# EAGLE design Robot_Psoc (EAGLE 7.5.0)
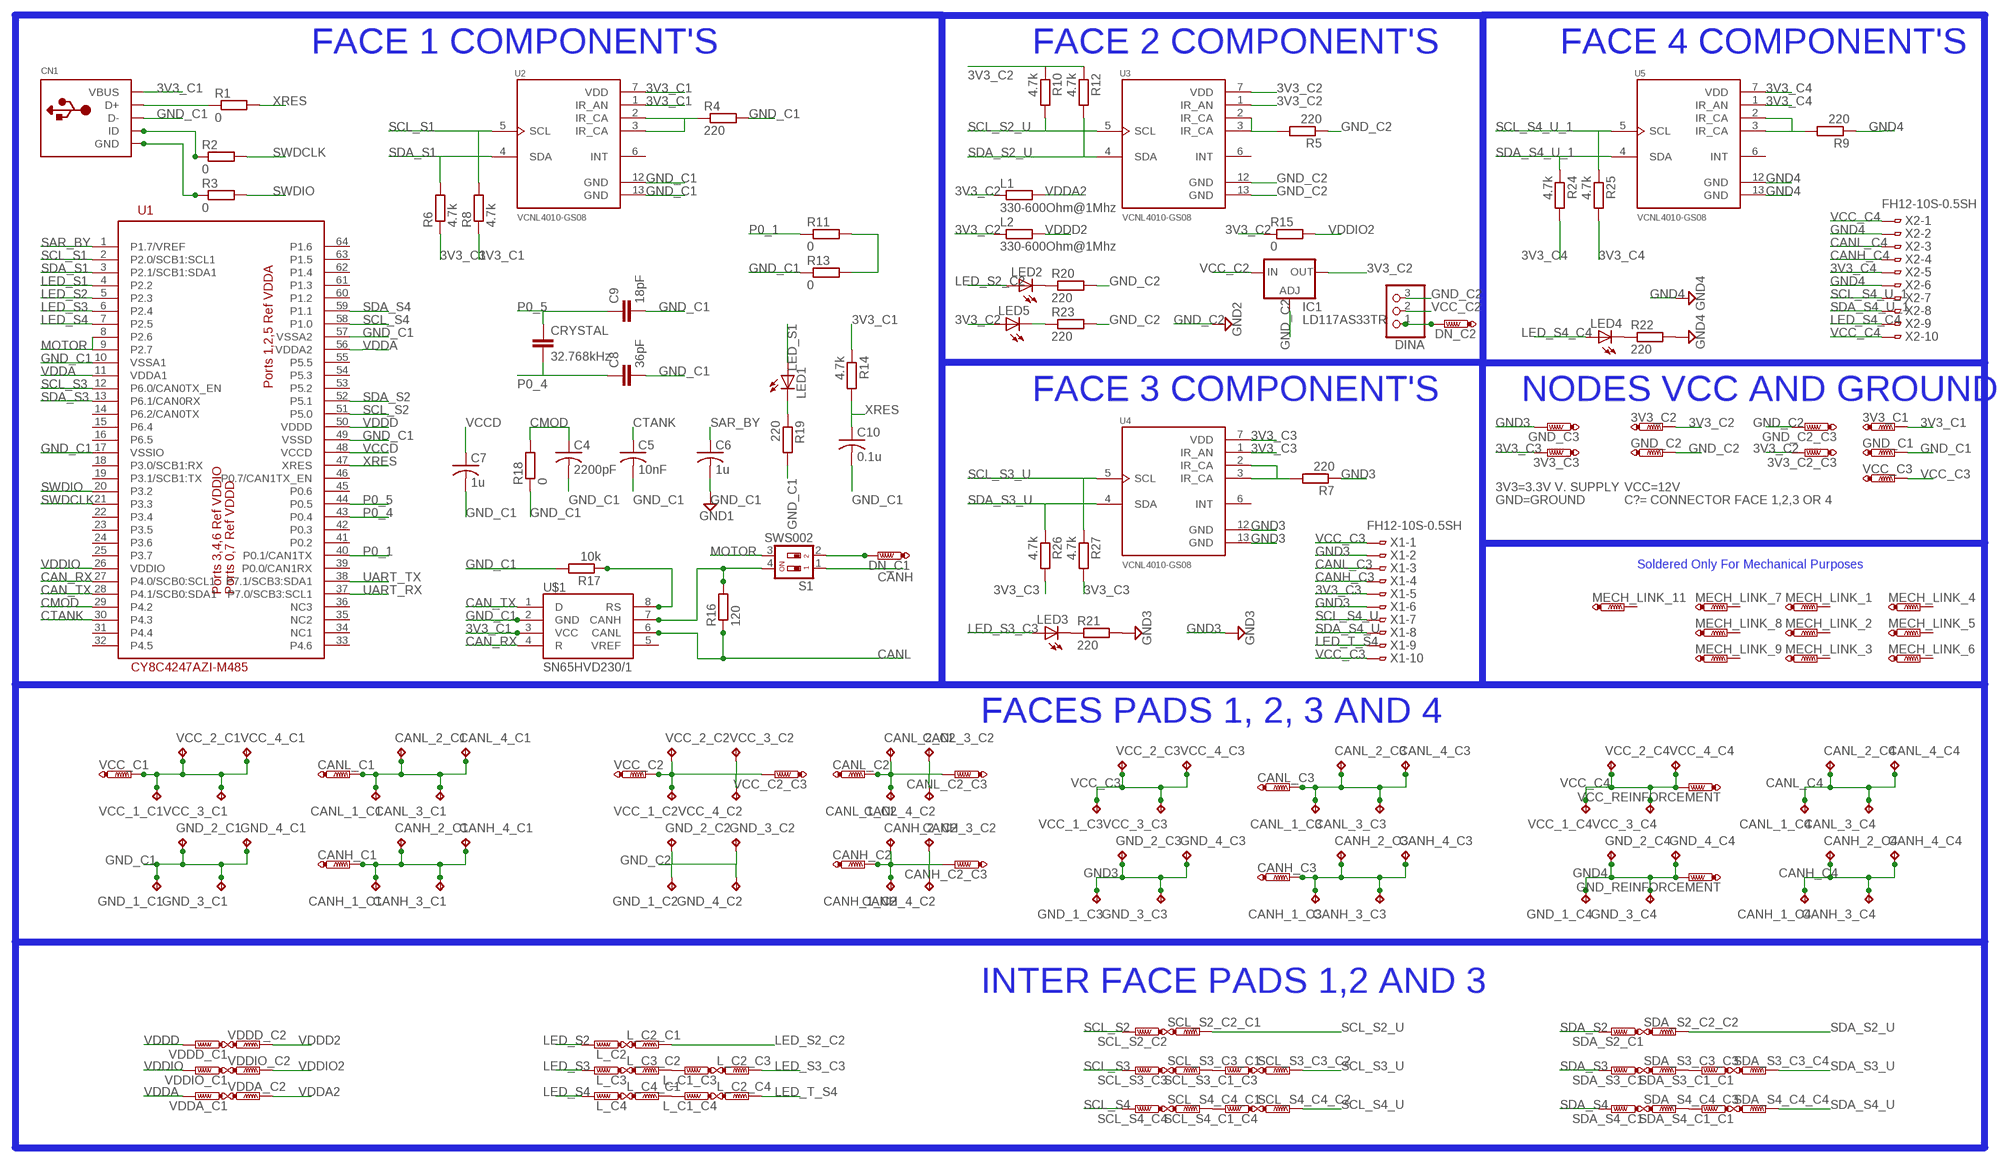
[diagram p0: schematic, sheet 1]

## Parts
3V3_C1  PTR1TP11R  [TP11R]
3V3_C2  PTR1TP11R  [TP11R]
3V3_C2_C3  PTR1TP11R  [TP11R]
3V3_C3  PTR1TP11R  [TP11R]
C4  2200pF  C-USC0805  [C0805]
C5  10nF  C-USC0805  [C0805]
C6  1u  C-USC0805  [C0805]
C7  1u  C-USC0805  [C0805]
C8  36pF  C-EUC0805  [C0805]
C9  18pF  C-EUC0805  [C0805]
C10  0.1u  C-USC0805  [C0805]
CANH_1_C1  TPB2,54  [B2,54]
CANH_1_C2  TPB2,54  [B2,54]
CANH_1_C3  TPB2,54  [B2,54]
CANH_1_C4  TPB2,54  [B2,54]
CANH_2_C1  TPB2,54  [B2,54]
CANH_2_C2  TPB2,54  [B2,54]
CANH_2_C3  TPB2,54  [B2,54]
CANH_2_C4  TPB2,54  [B2,54]
CANH_3_C1  TPB2,54  [B2,54]
CANH_3_C2  TPB2,54  [B2,54]
CANH_3_C3  TPB2,54  [B2,54]
CANH_3_C4  TPB2,54  [B2,54]
CANH_4_C1  TPB2,54  [B2,54]
CANH_4_C2  TPB2,54  [B2,54]
CANH_4_C3  TPB2,54  [B2,54]
CANH_4_C4  TPB2,54  [B2,54]
CANH_C1  PTR1TP11R  [TP11R]
CANH_C2  PTR1TP11R  [TP11R]
CANH_C2_C3  PTR1TP11R  [TP11R]
CANH_C3  PTR1TP11R  [TP11R]
CANL_1_C1  TPB2,54  [B2,54]
CANL_1_C2  TPB2,54  [B2,54]
CANL_1_C3  TPB2,54  [B2,54]
CANL_1_C4  TPB2,54  [B2,54]
CANL_2_C1  TPB2,54  [B2,54]
CANL_2_C2  TPB2,54  [B2,54]
CANL_2_C3  TPB2,54  [B2,54]
CANL_2_C4  TPB2,54  [B2,54]
CANL_3_C1  TPB2,54  [B2,54]
CANL_3_C2  TPB2,54  [B2,54]
CANL_3_C3  TPB2,54  [B2,54]
CANL_3_C4  TPB2,54  [B2,54]
CANL_4_C1  TPB2,54  [B2,54]
CANL_4_C2  TPB2,54  [B2,54]
CANL_4_C3  TPB2,54  [B2,54]
CANL_4_C4  TPB2,54  [B2,54]
CANL_C1  PTR1TP11R  [TP11R]
CANL_C2  PTR1TP11R  [TP11R]
CANL_C2_C3  PTR1TP11R  [TP11R]
CANL_C3  PTR1TP11R  [TP11R]
CN1  USBMINIB  [USB-MINIB]
CRYSTAL  32.768kHz  C-EUC0603  [C0603]
DINA  PINHD-1X3  [1X03]
DN_C1  PTR1TP11R  [TP11R]
DN_C2  PTR1TP11R  [TP11R]
GND_1_C1  TPB2,54  [B2,54]
GND_1_C2  TPB2,54  [B2,54]
GND_1_C3  TPB2,54  [B2,54]
GND_1_C4  TPB2,54  [B2,54]
GND_2_C1  TPB2,54  [B2,54]
GND_2_C2  TPB2,54  [B2,54]
GND_2_C3  TPB2,54  [B2,54]
GND_2_C4  TPB2,54  [B2,54]
GND_3_C1  TPB2,54  [B2,54]
GND_3_C2  TPB2,54  [B2,54]
GND_3_C3  TPB2,54  [B2,54]
GND_3_C4  TPB2,54  [B2,54]
GND_4_C1  TPB2,54  [B2,54]
GND_4_C2  TPB2,54  [B2,54]
GND_4_C3  TPB2,54  [B2,54]
GND_4_C4  TPB2,54  [B2,54]
GND_C1  PTR1TP11R  [TP11R]
GND_C2  PTR1TP11R  [TP11R]
GND_C2_C3  PTR1TP11R  [TP11R]
GND_C3  PTR1TP11R  [TP11R]
GND_REINFORCEMENT  PTR1TP11R  [TP11R]
IC1  LD117AS33TR  [SOT223]
L1  330-600Ohm@1Mhz  R-EU_R0805  [R0805]
L2  330-600Ohm@1Mhz  R-EU_R0805  [R0805]
L_C1_C3  PTR1TP11R  [TP11R]
L_C1_C4  PTR1TP11R  [TP11R]
L_C2  PTR1TP11R  [TP11R]
L_C2_C1  PTR1TP11R  [TP11R]
L_C2_C3  PTR1TP11R  [TP11R]
L_C2_C4  PTR1TP11R  [TP11R]
L_C3  PTR1TP11R  [TP11R]
L_C3_C2  PTR1TP11R  [TP11R]
L_C4  PTR1TP11R  [TP11R]
L_C4_C1  PTR1TP11R  [TP11R]
LED1  LEDCHIPLED_0805  [CHIPLED_0805]
LED2  LEDCHIPLED_0805  [CHIPLED_0805]
LED3  LEDCHIPLED_0805  [CHIPLED_0805]
LED4  LEDCHIPLED_0805  [CHIPLED_0805]
LED5  LEDCHIPLED_0805  [CHIPLED_0805]
MECH_LINK_1  PTR1TP11R  [TP11R]
MECH_LINK_2  PTR1TP11R  [TP11R]
MECH_LINK_3  PTR1TP11R  [TP11R]
MECH_LINK_4  PTR1TP11R  [TP11R]
MECH_LINK_5  PTR1TP11R  [TP11R]
MECH_LINK_6  PTR1TP11R  [TP11R]
MECH_LINK_7  PTR1TP11R  [TP11R]
MECH_LINK_8  PTR1TP11R  [TP11R]
MECH_LINK_9  PTR1TP11R  [TP11R]
MECH_LINK_11  PTR1TP11R  [TP11R]
R1  0  R-EU_R0805  [R0805]
R2  0  R-EU_R0805  [R0805]
R3  0  R-EU_R0805  [R0805]
R4  220  R-EU_R0805  [R0805]
R5  220  R-EU_R0805  [R0805]
R6  4.7k  R-EU_R0805  [R0805]
R7  220  R-EU_R0805  [R0805]
R8  4.7k  R-EU_R0805  [R0805]
R9  220  R-EU_R0805  [R0805]
R10  4.7k  R-EU_R0805  [R0805]
R11  0  R-EU_R0805  [R0805]
R12  4.7k  R-EU_R0805  [R0805]
R13  0  R-EU_R0805  [R0805]
R14  4.7k  R-EU_R0805  [R0805]
R15  0  R-EU_R0805  [R0805]
R16  120  R-EU_R0805  [R0805]
R17  10k  R-EU_R0805  [R0805]
R18  0  R-EU_R0805  [R0805]
R19  220  R-EU_R0805  [R0805]
R20  220  R-EU_R0805  [R0805]
R21  220  R-EU_R0805  [R0805]
R22  220  R-EU_R0805  [R0805]
R23  220  R-EU_R0805  [R0805]
R24  4.7k  R-EU_R0805  [R0805]
R25  4.7k  R-EU_R0805  [R0805]
R26  4.7k  R-EU_R0805  [R0805]
R27  4.7k  R-EU_R0805  [R0805]
S1  SWS002  [SMS-002]
SCL_S2_C2  PTR1TP11R  [TP11R]
SCL_S2_C2_C1  PTR1TP11R  [TP11R]
SCL_S3_C1_C3  PTR1TP11R  [TP11R]
SCL_S3_C3  PTR1TP11R  [TP11R]
SCL_S3_C3_C1  PTR1TP11R  [TP11R]
SCL_S3_C3_C2  PTR1TP11R  [TP11R]
SCL_S4_C1_C4  PTR1TP11R  [TP11R]
SCL_S4_C4  PTR1TP11R  [TP11R]
SCL_S4_C4_C1  PTR1TP11R  [TP11R]
SCL_S4_C4_C2  PTR1TP11R  [TP11R]
SDA_S2_C1  PTR1TP11R  [TP11R]
SDA_S2_C2_C2  PTR1TP11R  [TP11R]
SDA_S3_C1  PTR1TP11R  [TP11R]
SDA_S3_C1_C1  PTR1TP11R  [TP11R]
SDA_S3_C3_C3  PTR1TP11R  [TP11R]
SDA_S3_C3_C4  PTR1TP11R  [TP11R]
SDA_S4_C1  PTR1TP11R  [TP11R]
SDA_S4_C1_C1  PTR1TP11R  [TP11R]
SDA_S4_C4_C3  PTR1TP11R  [TP11R]
SDA_S4_C4_C4  PTR1TP11R  [TP11R]
U1  CY8C4247AZI-M485  [TQFP64-10X10]
U2  VCNL4010-GS08  [XDCR_VCNL4010-GS08]
U3  VCNL4010-GS08  [XDCR_VCNL4010-GS08]
U4  VCNL4010-GS08  [XDCR_VCNL4010-GS08]
U5  VCNL4010-GS08  [XDCR_VCNL4010-GS08]
U$1  SN65HVD230/1  [SO8]
VCC_1_C1  TPB2,54  [B2,54]
VCC_1_C2  TPB2,54  [B2,54]
VCC_1_C3  TPB2,54  [B2,54]
VCC_1_C4  TPB2,54  [B2,54]
VCC_2_C1  TPB2,54  [B2,54]
VCC_2_C2  TPB2,54  [B2,54]
VCC_2_C3  TPB2,54  [B2,54]
VCC_2_C4  TPB2,54  [B2,54]
VCC_3_C1  TPB2,54  [B2,54]
VCC_3_C2  TPB2,54  [B2,54]
VCC_3_C3  TPB2,54  [B2,54]
VCC_3_C4  TPB2,54  [B2,54]
VCC_4_C1  TPB2,54  [B2,54]
VCC_4_C2  TPB2,54  [B2,54]
VCC_4_C3  TPB2,54  [B2,54]
VCC_4_C4  TPB2,54  [B2,54]
VCC_C1  PTR1TP11R  [TP11R]
VCC_C2  PTR1TP11R  [TP11R]
VCC_C2_C3  PTR1TP11R  [TP11R]
VCC_C3  PTR1TP11R  [TP11R]
VCC_REINFORCEMENT  PTR1TP11R  [TP11R]
VDDA_C1  PTR1TP11R  [TP11R]
VDDA_C2  PTR1TP11R  [TP11R]
VDDD_C1  PTR1TP11R  [TP11R]
VDDD_C2  PTR1TP11R  [TP11R]
VDDIO_C1  PTR1TP11R  [TP11R]
VDDIO_C2  PTR1TP11R  [TP11R]
X1  FH12-10S-0.5SH  [FH12-10S-0.5SH]
X2  FH12-10S-0.5SH  [FH12-10S-0.5SH]

## Nets
3V3_C1: 3V3_C1.TP CN1.VBUS R6.1 R8.1 R14.1 U2.1(IR_AN) U2.7(VDD) U$1.3(VCC)
3V3_C2: 3V3_C2.TP 3V3_C2_C3.TP IC1.4(OUT) L1.1 L2.1 LED5.A R10.1 R12.1 R15.1 U3.1(IR_AN) U3.7(VDD)
3V3_C3: 3V3_C3.TP R26.2 R27.2 U4.1(IR_AN) U4.7(VDD) X1.5
3V3_C4: R24.2 R25.2 U5.1(IR_AN) U5.7(VDD) X2.5
CAN_RX: U1.27(P4.0/SCB0:SCL1) U$1.4(R)
CAN_TX: U1.28(P4.1/SCB0:SDA1) U$1.1(D)
CANH: CANH_1_C1.TP CANH_2_C1.TP CANH_3_C1.TP CANH_4_C1.TP CANH_C1.TP S1.1
CANH_C3: CANH_1_C3.TP CANH_2_C3.TP CANH_3_C3.TP CANH_4_C3.TP CANH_C3.TP X1.4
CANH_C4: CANH_1_C4.TP CANH_2_C4.TP CANH_3_C4.TP CANH_4_C4.TP X2.4
CANL: CANL_1_C1.TP CANL_2_C1.TP CANL_3_C1.TP CANL_4_C1.TP CANL_C1.TP R16.1 U$1.6(CANL)
CANL_C3: CANL_1_C3.TP CANL_2_C3.TP CANL_3_C3.TP CANL_4_C3.TP CANL_C3.TP X1.3
CANL_C4: CANL_1_C4.TP CANL_2_C4.TP CANL_3_C4.TP CANL_4_C4.TP X2.3
CMOD: C4.1 R18.2 U1.29(P4.2)
CTANK: C5.1 U1.30(P4.3)
GND3: GND_1_C3.TP GND_2_C3.TP GND_3_C3.TP GND_4_C3.TP GND_C3.TP R7.1 R21.2 U4.12(GND) U4.13(GND) X1.2 X1.6
GND4: GND_1_C4.TP GND_2_C4.TP GND_3_C4.TP GND_4_C4.TP GND_REINFORCEMENT.TP R9.1 R22.2 U5.12(GND) U5.13(GND) X2.2 X2.6
GND_C1: C4.2 C5.2 C6.2 C7.2 C8.2 C9.2 C10.2 CN1.D- GND_1_C1.TP GND_2_C1.TP GND_3_C1.TP GND_4_C1.TP GND_C1.TP R4.2 R13.1 R17.2 R18.1 R19.2 U1.10(VSSA1) U1.17(VSSIO) U1.49(VSSD) U1.57(VSSA2) U2.12(GND) U2.13(GND) U$1.2(GND) ; supply symbol labelled GND1
GND_C2: DINA.3 GND_1_C2.TP GND_2_C2.TP GND_3_C2.TP GND_4_C2.TP GND_C2.TP GND_C2_C3.TP IC1.1(ADJ) R5.1 R20.2 R23.2 U3.12(GND) U3.13(GND) ; supply symbol labelled GND2
LED_S1: LED1.A U1.4(P2.2)
LED_S2: L_C2.TP U1.5(P2.3)
LED_S2_C2: L_C2_C1.TP LED2.A
LED_S3: L_C3.TP U1.6(P2.4)
LED_S3_C3: L_C2_C3.TP LED3.A
LED_S4: L_C4.TP U1.7(P2.5)
LED_S4_C4: LED4.A X2.9
LED_T_S4: L_C2_C4.TP X1.9
MOTOR: S1.3 U1.8(P2.6) U1.9(P2.7)
N$1: CN1.D+ R1.1
N$2: CN1.ID R2.1
N$3: CN1.GND R3.1
N$4: R11.2 R13.2
N$5: R16.2 S1.4 U$1.7(CANH)
N$7: CANH_1_C2.TP CANH_2_C2.TP CANH_3_C2.TP CANH_4_C2.TP CANH_C2.TP CANH_C2_C3.TP
N$8: R7.2 U4.2(IR_CA) U4.3(IR_CA)
N$9: R17.1 U$1.8(RS)
N$10: SDA_S3_C1_C1.TP SDA_S3_C3_C3.TP
N$13: DN_C1.TP S1.2
N$14: LED1.C R19.1
N$15: LED2.C R20.1
N$16: LED3.C R21.1
N$17: LED4.C R22.1
N$18: LED5.C R23.1
N$19: DINA.1 DN_C2.TP
N$20: L_C1_C4.TP L_C4_C1.TP
N$21: R4.1 U2.2(IR_CA) U2.3(IR_CA)
N$22: L_C1_C3.TP L_C3_C2.TP
N$26: SCL_S3_C1_C3.TP SCL_S3_C3_C1.TP
N$27: SCL_S4_C1_C4.TP SCL_S4_C4_C1.TP
N$29: VCC_1_C1.TP VCC_2_C1.TP VCC_3_C1.TP VCC_4_C1.TP VCC_C1.TP
N$32: CANL_1_C2.TP CANL_2_C2.TP CANL_3_C2.TP CANL_4_C2.TP CANL_C2.TP CANL_C2_C3.TP
N$43: R5.2 U3.2(IR_CA) U3.3(IR_CA)
N$44: SDA_S4_C1_C1.TP SDA_S4_C4_C3.TP
N$46: R9.2 U5.2(IR_CA) U5.3(IR_CA)
P0_1: R11.1 U1.40(P0.1/CAN1TX)
P0_4: C8.1 CRYSTAL.2 U1.43(P0.4)
P0_5: C9.1 CRYSTAL.1 U1.44(P0.5)
SAR_BY: C6.1 U1.1(P1.7/VREF)
SCL_S1: R8.2 U1.2(P2.0/SCB1:SCL1) U2.5(SCL)
SCL_S2: SCL_S2_C2.TP U1.51(P5.0)
SCL_S2_U: R10.2 SCL_S2_C2_C1.TP U3.5(SCL)
SCL_S3: SCL_S3_C3.TP U1.12(P6.0/CAN0TX_EN)
SCL_S3_U: R27.1 SCL_S3_C3_C2.TP U4.5(SCL)
SCL_S4: SCL_S4_C4.TP U1.58(P1.0)
SCL_S4_U: SCL_S4_C4_C2.TP X1.7
SCL_S4_U_1: R25.1 U5.5(SCL) X2.7
SDA_S1: R6.2 U1.3(P2.1/SCB1:SDA1) U2.4(SDA)
SDA_S2: SDA_S2_C1.TP U1.52(P5.1)
SDA_S2_U: R12.2 SDA_S2_C2_C2.TP U3.4(SDA)
SDA_S3: SDA_S3_C1.TP U1.13(P6.1/CAN0RX)
SDA_S3_U: R26.1 SDA_S3_C3_C4.TP U4.4(SDA)
SDA_S4: SDA_S4_C1.TP U1.59(P1.1)
SDA_S4_U: SDA_S4_C4_C4.TP X1.8
SDA_S4_U_1: R24.1 U5.4(SDA) X2.8
SWDCLK: R2.2 U1.21(P3.3)
SWDIO: R3.2 U1.20(P3.2)
UART_RX: U1.37(P7.0/SCB3:SCL1)
UART_TX: U1.38(P7.1/SCB3:SDA1)
VCC_C2: DINA.2 IC1.3(IN) VCC_1_C2.TP VCC_2_C2.TP VCC_3_C2.TP VCC_4_C2.TP VCC_C2.TP VCC_C2_C3.TP
VCC_C3: VCC_1_C3.TP VCC_2_C3.TP VCC_3_C3.TP VCC_4_C3.TP VCC_C3.TP X1.1 X1.10
VCC_C4: VCC_1_C4.TP VCC_2_C4.TP VCC_3_C4.TP VCC_4_C4.TP VCC_REINFORCEMENT.TP X2.1 X2.10
VCCD: C7.1 U1.48(VCCD)
VDDA: U1.11(VDDA1) U1.56(VDDA2) VDDA_C1.TP
VDDA2: L1.2 VDDA_C2.TP
VDDD: U1.50(VDDD) VDDD_C1.TP
VDDD2: L2.2 VDDD_C2.TP
VDDIO: U1.26(VDDIO) VDDIO_C1.TP
VDDIO2: R15.2 VDDIO_C2.TP
XRES: C10.1 R1.2 R14.2 U1.47(XRES)
Unconnected: MECH_LINK_1.TP MECH_LINK_2.TP MECH_LINK_3.TP MECH_LINK_4.TP MECH_LINK_5.TP MECH_LINK_6.TP MECH_LINK_7.TP MECH_LINK_8.TP MECH_LINK_9.TP MECH_LINK_11.TP U1.14(P6.2/CAN0TX) U1.15(P6.4) U1.16(P6.5) U1.18(P3.0/SCB1:RX) U1.19(P3.1/SCB1:TX) U1.22(P3.4) U1.23(P3.5) U1.24(P3.6) U1.25(P3.7) U1.31(P4.4) U1.32(P4.5) U1.33(P4.6) U1.34(NC1) U1.35(NC2) U1.36(NC3) U1.39(P0.0/CAN1RX) U1.41(P0.2) U1.42(P0.3) U1.45(P0.6) U1.46(P0.7/CAN1TX_EN) U1.53(P5.2) U1.54(P5.3) U1.55(P5.5) U1.60(P1.2) U1.61(P1.3) U1.62(P1.4) U1.63(P1.5) U1.64(P1.6) U2.6(INT) U3.6(INT) U4.6(INT) U5.6(INT) U$1.5(VREF)

## Notes on the sheet
- FACE 1 COMPONENT'S | FACE 2 COMPONENT'S | FACE 4 COMPONENT'S
- FACE 3 COMPONENT'S | NODES VCC AND GROUND
- 3V3=3.3V V. SUPPLY | VCC=12V
- GND=GROUND | C?= CONNECTOR FACE 1,2,3 OR 4
- Soldered Only For Mechanical Purposes
- FACES PADS 1, 2, 3 AND 4
- INTER FACE PADS 1,2 AND 3

## Library data of the parts
3V3_C1 3V3_C2 3V3_C2_C3 3V3_C3 CANH_C1 CANH_C2 CANH_C2_C3 CANH_C3 CANL_C1 CANL_C2 CANL_C2_C3 CANL_C3 DN_C1 DN_C2 GND_C1 GND_C2 GND_C2_C3 GND_C3 GND_REINFORCEMENT L_C1_C3 L_C1_C4 L_C2 L_C2_C1 L_C2_C3 L_C2_C4 L_C3 L_C3_C2 L_C4 L_C4_C1 MECH_LINK_1-MECH_LINK_9 MECH_LINK_11 SCL_S2_C2 SCL_S2_C2_C1 SCL_S3_C1_C3 SCL_S3_C3 SCL_S3_C3_C1 SCL_S3_C3_C2 SCL_S4_C1_C4 SCL_S4_C4 SCL_S4_C4_C1 SCL_S4_C4_C2 SDA_S2_C1 SDA_S2_C2_C2 SDA_S3_C1 SDA_S3_C1_C1 SDA_S3_C3_C3 SDA_S3_C3_C4 SDA_S4_C1 SDA_S4_C1_C1 SDA_S4_C4_C3 SDA_S4_C4_C4 VCC_C1 VCC_C2 VCC_C2_C3 VCC_C3 VCC_REINFORCEMENT VDDA_C1 VDDA_C2 VDDD_C1 VDDD_C2 VDDIO_C1 VDDIO_C2 = testpad:PTR1: TEST PIN
C4-C7 C10 = rcl:C-US: CAPACITOR, American symbol
C8 C9 CRYSTAL = rcl:C-EU: CAPACITOR, European symbol
CANH_1_C1-CANH_1_C4 CANH_2_C1-CANH_2_C4 CANH_3_C1-CANH_3_C4 CANH_4_C1-CANH_4_C4 CANL_1_C1-CANL_1_C4 CANL_2_C1-CANL_2_C4 CANL_3_C1-CANL_3_C4 CANL_4_C1-CANL_4_C4 GND_1_C1-GND_1_C4 GND_2_C1-GND_2_C4 GND_3_C1-GND_3_C4 GND_4_C1-GND_4_C4 VCC_1_C1-VCC_1_C4 VCC_2_C1-VCC_2_C4 VCC_3_C1-VCC_3_C4 VCC_4_C1-VCC_4_C4 = testpad:TP: Test pad
CN1 = adafruit:USB: USB Connectors USBMINIB - Surface Mount Female Mini-B USB Connector 4UConnector: 06564 By microbuilder.eu Thru-hole RA Female Mini-B USB Connector 4UConnector: 18732 By ladyada.net
DINA = pinhead:PINHD-1X3: PIN HEADER
IC1 = v-reg:LD117A?*: Low drop fixed and adjustable positive voltage regulators 1 A Source: http://www.st.com/stonline/products/literature/ds/7194/ld1117axx.pdf
L1 L2 R1-R27 = rcl:R-EU_: RESISTOR, European symbol
LED1-LED5 = adafruit:LED: LED OSRAM: - CHIPLED LG R971, LG N971, LY N971, LG Q971, LY Q971, LO R971, LY R971 LH N974, LH R974 LS Q976, LO Q976, LY Q976 LO Q996 - Hyper CHIPLED LW Q18S LB Q993, LB Q99A, LB R99A - SideLED LS A670, LO A670, LY A670, LG A670, LP A670 LB A673, LV A673, LT A673, LW A673 LH A674 LY A675 LS A676, LA A676, LO A676, LY A676, LW A676 LS A679, LY A679, LG A679 - Hyper Micro SIDELED® LS Y876, LA Y876, LO Y876, LY Y876 LT Y87S - SmartLED LW L88C, LW L88S LB L89C, LB L89S, LG L890 LS L89K, LO L89K, LY L89K LS L896, LA L896, LO L896, LY L896 - TOPLED LS T670, LO T670, LY T670, LG T670, LP T670 LSG T670, LSP T670, LSY T670, LOP T670, LYG T670 LG T671, LOG T671, LSG T671 LB T673, LV T673, LT T673, LW T673 LH T674 LS T676, LA T676, LO T676, LY T676, LB T676, LH T676, LSB T676, LW T676 LB T67C, LV T67C, LT T67C, LS T67K, LO T67K, LY T67K, LW E67C LS E67B, LA E67B, LO E67B, LY E67B, LB E67C, LV E67C, LT E67C LW T67C LS T679, LY T679, LG T679 LS T770, LO T770, LY T770, LG T770, LP T770 LB T773, LV T773, LT T773, LW T773 LH T774 LS E675, LA E675, LY E675, LS T675 LS T776, LA T776, LO T776, LY T776, LB T776 LHGB T686 LT T68C, LB T68C - Hyper Mini TOPLED® LB M676 - Mini TOPLED Santana® LG M470 LS M47K, LO M47K, LY M47K Source: http://www.osram.convergy.de/
S1 = smd-special:SWS002: SMD Dip Switch 2 pol.
U1 = CypressPSoC:CY8C4247AZI-M485
U2-U5 = VCNL4010-GS08:VCNL4010-GS08
U$1 = texas_instruments:SN65HVD230/1
X1 X2 = con-hirose2:FH12-10S-0.5S: 0.5mm Pitch Connectors For FPC/FFC Source: Data sheet <http://www.hirose.co.jp/cataloge_hp/e58605370.pdf>; MPN: FH12-10S-0.5SH(55); OC_FARNELL: 1324540; OC_NEWARK: 34M6152

## Board
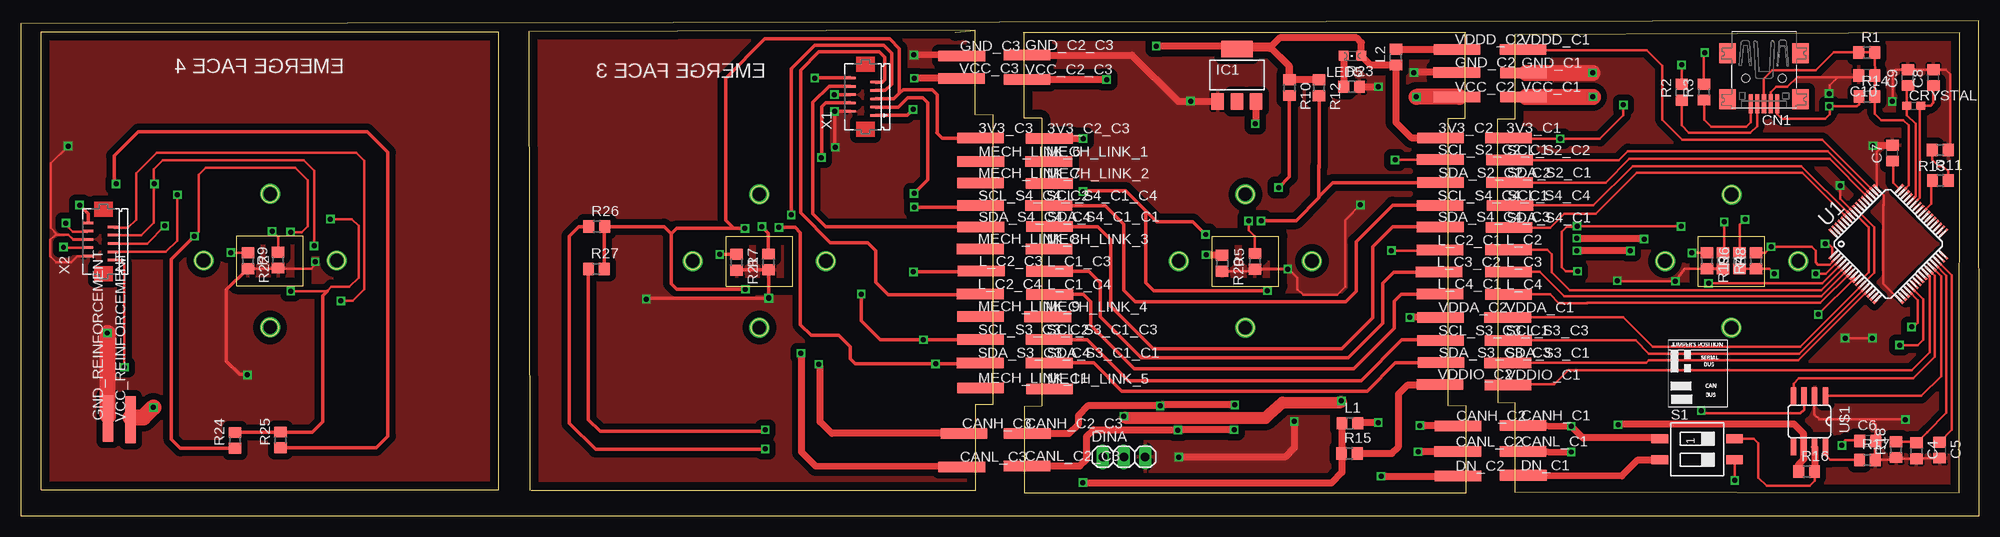
[diagram p1: board, top side]
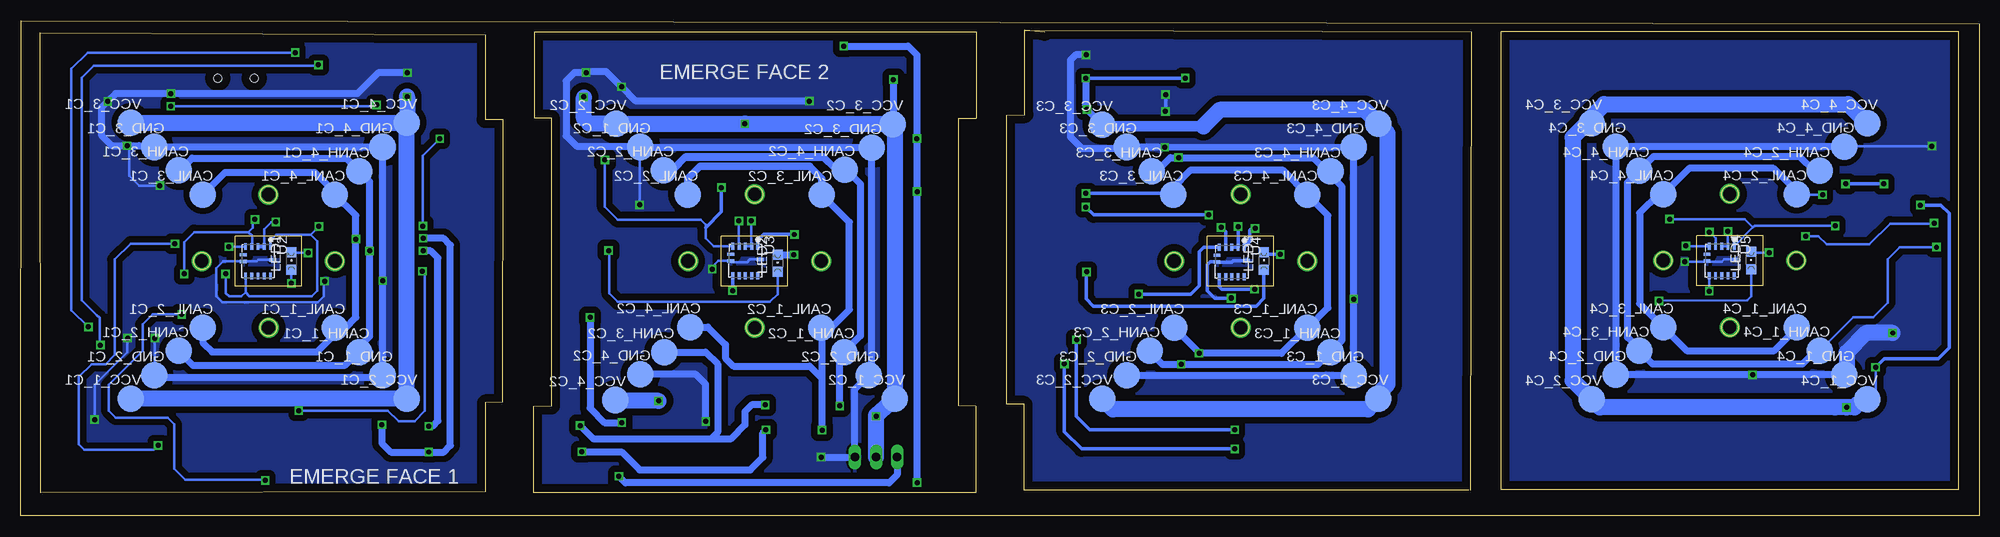
[diagram p2: board, bottom side, seen from below]

Size 235.34 x 59.49 mm. Coordinates in mm from the lower left corner, seen from the top.
Outline: 120.48,58.13 173.65,58.13
Outline: 114.68,58.34 114.68,48.21 116.87,48.13 116.84,13.41 114.76,13.39 114.76,3.1 61.32,3.05
Outline: 112.29,58.09 114.68,58.34
Outline: 114.68,58.34 61.06,58.17 61.19,3.05
Outline: 173.58,58.04 173.58,47.75 171.55,47.75 171.55,13.21 173.69,13.18 173.69,2.77 120.6,2.77 120.6,13.18 122.66,13.21 122.66,47.75 120.55,47.8 120.55,58.09
Outline: 0,0 235.34,0 235.29,59.49 0,59.11 0,0
Outline: 151.17,27.61 151.17,33.61 143.17,33.61 143.17,27.61 151.17,27.61
Outline: 2.45,3.16 2.45,58.16 57.45,58.16 57.45,3.16 2.45,3.16
Outline: 33.95,27.66 33.95,33.66 25.95,33.66 25.95,27.66 33.95,27.66
Outline: 92.75,27.61 92.75,33.61 84.75,33.61 84.75,27.61 92.75,27.61
Outline: 209.59,27.61 209.59,33.61 201.59,33.61 201.59,27.61 209.59,27.61
Outline: 179.53,47.65 177.42,47.68 177.47,13.67 179.5,13.56 179.5,2.9 232.97,2.79 233.02,58.04 179.53,57.81 179.53,47.65
Outline: circle at 139.17,30.61 radius 1
Outline: circle at 147.17,38.61 radius 1
Outline: circle at 155.17,30.61 radius 1
Outline: circle at 147.17,22.61 radius 1
Outline: circle at 21.95,30.66 radius 1
Outline: circle at 29.95,38.66 radius 1
Outline: circle at 37.95,30.66 radius 1
Outline: circle at 29.95,22.66 radius 1
Outline: circle at 80.75,30.61 radius 1
Outline: circle at 88.75,38.61 radius 1
Outline: circle at 96.75,30.61 radius 1
Outline: circle at 88.75,22.61 radius 1
Outline: circle at 197.59,30.61 radius 1
Outline: circle at 205.59,38.61 radius 1
Outline: circle at 213.59,30.61 radius 1
Outline: circle at 205.59,22.61 radius 1
Copper layers (1*16): Top 0.035mm / dielectric 1.5mm / Bottom 0.035mm
Design rules "default": minimum track width 10mil, minimum drill 24mil, track to track 8mil, track to pad 8mil, pad to pad 8mil, via to via 8mil, smd to smd 8mil, copper to edge 40mil, drill to drill 8mil, minimum pad ring 10mil, minimum via ring 8mil, stop-mask expansion 4mil, vias tented up to drill 0mil, thermal gap 10mil

### Footprints (pad centres in the part's own frame; a part is rotated, then mirrored left to right if it is on the bottom)
TP11R = smd 0.635 x 1.27: P$1 0.381,0; P$2 1.016,0; P$3 -0.254,0; P$4 -0.889,0; P$5 -1.524,0; P$6 1.613,0; P$7 2.21,0; P$8 -2.146,0; P$9 -2.769,0 | smd 1.1 x 1.1: TP 0,0
C0805 = smd 1.3 x 1.5: 1 -0.95,0; 2 0.95,0
B2,54 = smd 3.175 x 3.175 bottom: P$1 0,0 | smd 2.54 x 2.54 bottom: TP 0,0
USB-MINIB = smd 0.5 x 2.308: D+ 0,4.064; D- -0.8,4.064; GND 1.6,4.064; ID 0.8,4.064; VBUS -1.6,4.064 | smd 2 x 2.4: GND1 -4.4,-2; GND2 -4.4,3.5; GND3 4.4,3.5; GND4 4.4,-2 | hole 1: -2.2,1; 2.2,1
C0603 = smd 1.1 x 1: 1 -0.85,0; 2 0.85,0
1X03 = drill 1.016 long: 1 -2.54,0; 2 0,0; 3 2.54,0
SOT223 = smd 1.5 x 2: 1 -2.3,-3.15; 2 0,-3.15; 3 2.3,-3.15 | smd 3.8 x 2: 4 0,3.15
R0805 = smd 1.3 x 1.5: 1 -0.95,0; 2 0.95,0
CHIPLED_0805 = smd 1.2 x 1.2: A 0,-1.05; C 0,1.05
SMS-002 = smd 1.092 x 2.007: 1 -1.27,-4.496; 2 1.27,-4.496; 3 1.27,4.496; 4 -1.27,4.496
TQFP64-10X10 = smd 1.2 x 0.3: 1 -5.7,3.75; 2 -5.7,3.25; 3 -5.7,2.75; 4 -5.7,2.25; 5 -5.7,1.75; 6 -5.7,1.25; 7 -5.7,0.75; 8 -5.7,0.25; 9 -5.7,-0.25; 10 -5.7,-0.75; 11 -5.7,-1.25; 12 -5.7,-1.75; 13 -5.7,-2.25; 14 -5.7,-2.75; 15 -5.7,-3.25; 16 -5.7,-3.75; 33 5.7,-3.75; 34 5.7,-3.25; 35 5.7,-2.75; 36 5.7,-2.25; 37 5.7,-1.75; 38 5.7,-1.25; 39 5.7,-0.75; 40 5.7,-0.25; 41 5.7,0.25; 42 5.7,0.75; 43 5.7,1.25; 44 5.7,1.75; 45 5.7,2.25; 46 5.7,2.75; 47 5.7,3.25; 48 5.7,3.75 | smd 0.3 x 1.2: 17 -3.75,-5.7; 18 -3.25,-5.7; 19 -2.75,-5.7; 20 -2.25,-5.7; 21 -1.75,-5.7; 22 -1.25,-5.7; 23 -0.75,-5.7; 24 -0.25,-5.7; 25 0.25,-5.7; 26 0.75,-5.7; 27 1.25,-5.7; 28 1.75,-5.7; 29 2.25,-5.7; 30 2.75,-5.7; 31 3.25,-5.7; 32 3.75,-5.7; 49 3.75,5.7; 50 3.25,5.7; 51 2.75,5.7; 52 2.25,5.7; 53 1.75,5.7; 54 1.25,5.7; 55 0.75,5.7; 56 0.25,5.7; 57 -0.25,5.7; 58 -0.75,5.7; 59 -1.25,5.7; 60 -1.75,5.7; 61 -2.25,5.7; 62 -2.75,5.7; 63 -3.25,5.7; 64 -3.75,5.7
XDCR_VCNL4010-GS08 = smd 0.805 x 0.35: 1 -1.772,1.5; 2 -1.772,0.75; 3 -1.772,0; 4 -1.772,-0.75; 5 -1.772,-1.5; 7 1.772,-1.5; 8 1.772,-0.75; 9 1.772,0; 10 1.772,0.75; 11 1.772,1.5 | smd 0.4 x 0.805: 6 -0.8,-1.772; 12 -0.175,1.772; 13 0,-1.772
SO8 = smd 0.66 x 2.032: 1 -1.905,-3.073; 2 -0.635,-3.073; 3 0.635,-3.073; 4 1.905,-3.073; 5 1.905,3.073; 6 0.635,3.073; 7 -0.635,3.073; 8 -1.905,3.073
FH12-10S-0.5SH = smd 0.3 x 1.3: 1 -2.25,-1.195; 2 -1.75,1.853; 3 -1.25,-1.195; 4 -0.75,1.853; 5 -0.25,-1.195; 6 0.25,1.853; 7 0.75,-1.195; 8 1.25,1.853; 9 1.75,-1.195; 10 2.25,1.853

### Placement (x,y rotation side)
3V3_C1  179.07,45.42 0 top
3V3_C2  170.89,45.42 0 top
3V3_C2_C3  123.88,45.36 0 top
3V3_C3  115.62,45.39 0 top
C4  227.79,7.82 270 top
C5  230.58,7.9 270 top
C6  221.95,9.02 0 top
C7  224.92,43.59 90 top
C8  229.84,52.65 90 top
C9  226.77,52.65 90 top
C10  221.82,52.93 180 top
CANH_1_C1  194.67,19.69 0 top
CANH_1_C2  136.37,19.69 0 top
CANH_1_C3  77.95,19.69 0 top
CANH_1_C4  19.15,19.86 0 top
CANH_2_C1  216.38,19.81 0 top
CANH_2_C2  158.09,41.53 0 top
CANH_2_C3  99.67,19.81 0 top
CANH_2_C4  19.15,41.45 0 top
CANH_3_C1  216.38,41.53 0 top
CANH_3_C2  158.04,19.69 0 top
CANH_3_C3  99.42,41.4 0 top
CANH_3_C4  40.87,19.86 0 top
CANH_4_C1  194.67,41.4 0 top
CANH_4_C2  136.32,41.58 0 top
CANH_4_C3  77.95,41.4 0 top
CANH_4_C4  40.87,41.45 0 top
CANH_C1  180.8,10.87 0 top
CANH_C2  173,10.82 0 top
CANH_C2_C3  121.23,9.91 0 top
CANH_C3  113.61,9.91 0 top
CANL_1_C1  197.59,22.61 0 top
CANL_1_C2  139.17,22.61 0 top
CANL_1_C3  80.75,22.61 0 top
CANL_1_C4  21.95,22.66 0 top
CANL_2_C1  213.46,22.61 0 top
CANL_2_C2  155.17,38.61 0 top
CANL_2_C3  96.75,22.61 0 top
CANL_2_C4  21.95,38.66 0 top
CANL_3_C1  213.46,38.61 0 top
CANL_3_C2  139.06,38.58 0 top
CANL_3_C3  96.88,38.61 0 top
CANL_3_C4  37.95,22.66 0 top
CANL_4_C1  197.59,38.61 0 top
CANL_4_C2  154.86,22.68 0 top
CANL_4_C3  80.75,38.61 0 top
CANL_4_C4  37.95,38.66 0 top
CANL_C1  180.8,7.75 0 top
CANL_C2  172.95,7.72 0 top
CANL_C2_C3  121.18,5.99 0 top
CANL_C3  113.36,5.89 0 top
CN1  209.47,53.57 180 top
CRYSTAL  227.48,49.28 0 top
DINA  132.56,7.09 0 top
DN_C1  180.82,4.88 0 top
DN_C2  172.97,4.8 0 top
GND_1_C1  191.87,16.89 0 top
GND_1_C2  160.88,44.32 0 top
GND_1_C3  75.16,16.89 0 top
GND_1_C4  16.23,16.94 0 top
GND_2_C1  219.3,16.89 0 top
GND_2_C2  133.45,16.89 0 top
GND_2_C3  102.46,16.89 0 top
GND_2_C4  43.66,16.94 0 top
GND_3_C1  219.3,44.32 0 top
GND_3_C2  133.1,44.22 0 top
GND_3_C3  102.46,44.32 0 top
GND_3_C4  43.66,44.37 0 top
GND_4_C1  191.87,44.32 0 top
GND_4_C2  160.88,17.02 0 top
GND_4_C3  75.16,44.32 0 top
GND_4_C4  16.23,44.37 0 top
GND_C1  180.85,53.24 0 top
GND_C2  172.85,53.29 0 top
GND_C2_C3  121.21,55.37 0 top
GND_C3  113.36,55.27 0 top
GND_REINFORCEMENT  10.46,11.99 90 top
IC1  146.13,52.96 0 top
L1  159.72,11.13 0 top
L2  165.23,55.12 90 top
L_C1_C3  123.9,29.39 0 top
L_C1_C4  123.93,26.62 0 top
L_C2  179.04,31.98 0 top
L_C2_C1  170.81,31.93 0 top
L_C2_C3  115.7,29.41 0 top
L_C2_C4  115.57,26.64 0 top
L_C3  179.07,29.31 0 top
L_C3_C2  170.71,29.31 0 top
L_C4  179.07,26.62 0 top
L_C4_C1  170.81,26.67 0 top
LED1  202.82,30.61 0 bottom
LED2  144.37,30.35 0 bottom
LED3  85.95,30.61 0 bottom
LED4  27.41,30.66 0 bottom
LED5  160.05,55.27 90 top
MECH_LINK_1  123.8,42.57 0 top
MECH_LINK_2  123.88,39.95 0 top
MECH_LINK_3  123.85,32.05 0 top
MECH_LINK_4  123.7,23.93 0 top
MECH_LINK_5  123.9,15.27 0 top
MECH_LINK_6  115.65,42.57 0 top
MECH_LINK_7  115.62,39.98 0 top
MECH_LINK_8  115.57,32.08 0 top
MECH_LINK_9  115.6,23.98 0 top
MECH_LINK_11  115.6,15.37 0 top
R1  221.82,55.65 0 top
R2  199.59,50.9 90 top
R3  202.26,50.93 90 top
R4  204.57,30.66 270 top
R5  148.29,30.58 90 top
R6  206.55,30.66 90 top
R7  89.84,30.51 90 top
R8  208.53,30.66 90 top
R9  30.91,30.73 90 top
R10  152.45,51.46 270 top
R11  230.68,40.28 0 top
R12  156.01,51.44 270 top
R13  230.66,43.97 180 top
R14  221.84,50.39 0 top
R15  159.66,7.49 0 top
R16  214.6,5.31 0 top
R17  221.89,6.73 0 top
R18  225.35,7.95 90 top
R19  202.64,30.66 270 top
R20  144.37,30.35 270 top
R21  86.03,30.48 270 top
R22  27.28,30.66 270 top
R23  159.92,51.56 0 top
R24  25.73,9.07 90 top
R25  31.22,9.12 90 top
R26  69.22,34.75 0 top
R27  69.16,29.67 0 top
S1  201.45,8 270 top
SCL_S2_C2  179.17,42.75 0 top
SCL_S2_C2_C1  170.84,42.8 0 top
SCL_S3_C1_C3  123.85,21.18 0 top
SCL_S3_C3  179.02,21.08 0 top
SCL_S3_C3_C1  170.89,21.08 0 top
SCL_S3_C3_C2  115.6,21.18 0 top
SCL_S4_C1_C4  123.8,37.29 0 top
SCL_S4_C4  179.22,37.31 0 top
SCL_S4_C4_C1  170.81,37.29 0 top
SCL_S4_C4_C2  115.62,37.29 0 top
SDA_S2_C1  179.17,40.06 0 top
SDA_S2_C2_C2  170.89,40.03 0 top
SDA_S3_C1  178.97,18.39 0 top
SDA_S3_C1_C1  123.88,18.39 0 top
SDA_S3_C3_C3  170.94,18.42 0 top
SDA_S3_C3_C4  115.57,18.39 0 top
SDA_S4_C1  179.12,34.65 0 top
SDA_S4_C1_C1  123.9,34.75 0 top
SDA_S4_C4_C3  170.84,34.72 0 top
SDA_S4_C4_C4  115.65,34.72 0 top
U1  224.41,32.66 45 top
U2  206.83,30.58 270 bottom
U3  148.26,30.63 270 bottom
U4  89.81,30.51 270 bottom
U5  30.94,30.63 270 bottom
U$1  214.93,11.35 180 top
VCC_1_C1  222.1,14.1 0 top
VCC_1_C2  130.33,14.1 0 top
VCC_1_C3  72.24,14.1 0 top
VCC_1_C4  13.44,14.02 0 top
VCC_2_C1  188.95,14.1 0 top
VCC_2_C2  163.8,47.12 0 top
VCC_2_C3  105.38,14.1 0 top
VCC_2_C4  46.58,14.02 0 top
VCC_3_C1  222.1,47.24 0 top
VCC_3_C2  130.56,47.07 0 top
VCC_3_C3  105.38,46.99 0 top
VCC_3_C4  46.58,47.17 0 top
VCC_4_C1  188.95,47.24 0 top
VCC_4_C2  163.88,13.92 0 top
VCC_4_C3  72.24,47.12 0 top
VCC_4_C4  13.44,47.17 0 top
VCC_C1  180.85,50.34 0 top
VCC_C2  172.87,50.34 0 top
VCC_C2_C3  121.21,52.45 0 top
VCC_C3  113.31,52.58 0 top
VCC_REINFORCEMENT  13.16,11.84 90 top
VDDA_C1  178.97,23.85 0 top
VDDA_C2  170.89,23.85 0 top
VDDD_C1  180.8,56.03 0 top
VDDD_C2  172.87,56.06 0 top
VDDIO_C1  178.99,15.75 0 top
VDDIO_C2  170.81,15.8 0 top
X1  101.52,50.37 90 top
X2  9.93,32.97 90 top

### Tracks (layer width: path | path; a pad name or v marks a point on that pad's centre or on a via)
3V3_C1  (via drill 0.6)
  Top 0.305: 220.9,50.38 R14.1 220.89,49.47 220.65,49.22 v217.32,49.22 | 217.42,49.17 v217.32,49.22 | v192.58,49.38 192.58,48.13 189.76,45.31 v184.99,45.31 | v184.99,45.31 180.14,45.31 179.81,45.64 179.3,45.64 3V3_C1.TP 179.17,45.31 v184.99,45.31 | CN1.VBUS 211.07,48.26 211.61,47.73 216.81,47.73 217.37,48.28 217.37,49.17 v217.32,49.22 | v199.52,34.77 187.2,34.8 v187.02,34.82 186.94,34.75 185.8,34.75 185.17,34.11 185.17,29.9 185.67,29.39 v187.07,29.39 | U$1.3 214.3,12.78 213.84,12.32 202.26,12.32 v201.93,12.65 | R6.1 R8.1 210.09,29.71 v210.72,29.08
  Bottom 0.305: v217.32,49.22 192.74,49.22 v192.58,49.38 | U2.7 208.33,26.85 | 208.33,26.85 207.87,26.39 200.36,26.39 199.72,27.03 199.72,33.02 200.48,33.78 200.51,33.78 | U2.1 205.33,33.1 204.65,33.78 200.51,33.78 | 200.51,33.78 v199.52,34.77 | v187.02,34.82 187.02,43.28 v184.99,45.31 | v201.93,12.65 191.21,12.65 189.94,11.38 188.01,11.38 186.79,12.6 186.79,29.11 v187.07,29.39 | v210.72,29.08 210.72,26.77 210.31,26.36 208.82,26.36 208.33,26.85
3V3_C2  (via drill 0.6)
  Top 0.406: 150.01,56.16 150.15,56.3 | v149.81,27.05 136.12,27.05 135.18,27.99 135.18,36.65 | 135.18,36.65 132.77,39.06 127.74,39.06 v127.63,38.96 | 135.18,36.65 136.5,35.33 140.84,35.33 v142.37,33.81
  Top 0.813: 3V3_C2.TP 170.87,45.44 167.08,45.44 165.23,47.3 L2.1 162.2,54.17 LED5.A 161.1,56.86 160.53,57.43 151.28,57.43 150.15,56.3 | 150.15,56.3 150.04,56.19 146.2,56.19 IC1.4 | R15.1 158.77,7.54 L1.1 158.77,5.22 157.48,3.94 127.69,3.94 v127.63,3.99 | v127.66,45.34 123.9,45.34 3V3_C2_C3.TP | R12.1 152.48,52.39 | 152.48,52.39 R10.1 152.45,54 150.15,56.3 | 152.48,52.39 152.48,54 150.04,56.44 v136.45,56.44
  Bottom 0.406: U3.7 149.76,27.1 v149.81,27.05 | U3.1 146.76,33.17 146.08,33.86 142.42,33.86 v142.37,33.81
  Bottom 0.813: v127.63,3.99 v127.63,38.96 127.63,45.31 v127.66,45.34 127.66,55.4 128.7,56.44 v136.45,56.44
3V3_C3  (via drill 0.6)
  Top 0.406: 3V3_C3.TP 110.74,45.39 110.08,46.05 110.11,46.08 110.11,50.62 109.5,51.23 106.02,51.23 105.56,50.78 | X1.5 104.91,50.12 105.56,50.78 | v87.07,27.23 78.84,27.23 78.16,27.92 78.16,33.88 | 78.16,33.88 78.82,34.54 v87.02,34.54 85.67,34.54 84.68,35.53 84.68,52.58 89.41,57.3 104.39,57.3 105.56,56.13 105.56,50.78 | 78.16,33.88 77.29,34.75 R26.2 70.11,34.7 R27.2
  Bottom 0.406: U4.7 91.31,27.53 91.03,27.25 87.1,27.25 v87.07,27.23 | 87.4,34.54 v87.02,34.54 87.1,34.62 87.33,34.62 87.4,34.54 | 87.4,34.54 87.63,34.31 87.63,33 | 87.63,33 87.63,32.96 U4.1 88.31,32.31 87.63,33
3V3_C4  (via drill 0.6)
  Top 0.305: X2.5 15.17,32.72 v17.3,34.85 | v32.44,27 36.8,27 37.29,27.51 39.5,27.51 40.59,28.6 40.59,34.85 39.78,35.66 v37.21,35.66
  Top 0.406: R24.2 31.17,10.02 R25.2 35.04,10.07 36.27,11.3 36.27,26.47 36.8,27
  Bottom 0.305: v17.3,34.85 26.99,34.85 27.19,34.66 | 27.19,34.66 U5.1 | U5.7 32.44,27.15 v32.44,27 | v37.21,35.66 28.19,35.66 27.19,34.66
CAN_RX
  Top 0.305: U1.27 229.32,29.48 229.37,29.48 230,28.85 230,19.1 227.43,16.53 213.66,16.53 213.03,15.9 U$1.4 213.11,14.5
CAN_TX
  Top 0.305: U1.28 230.76,28.78 230.76,16.79 228.4,14.43 U$1.1
CANH  (via drill 0.6)
  Top 0.813: S1.1 196.85,9.37 187.71,9.37 v186.31,10.77 | 186.36,10.72 v186.31,10.77 | CANH_C1.TP 186.28,10.8 v186.31,10.77 | v193.42,31.83 187.02,31.83 v186.99,31.85
  Bottom 0.813: 216.89,19.81 CANH_2_C1.TP 214.63,18.06 196.42,18.06 194.79,19.69 CANH_1_C1.TP | CANH_1_C1.TP 193.4,19.69 | CANH_1_C1.TP 194.67,20.32 193.42,21.56 v193.42,31.83 193.42,40.16 CANH_4_C1.TP 196.24,42.98 214.76,42.98 216.2,41.53 CANH_3_C1.TP | v186.31,10.77 185.85,10.77 185.22,11.41 185.22,30.99 186.08,31.85 v186.99,31.85
CANH_C3  (via drill 0.6)
  Top 0.406: X1.4 96.74,49.62 96.27,49.15 96.27,43.1 v96.22,43.05
  Top 0.813: CANH_C3.TP 97.46,9.91 96.06,11.3 96.06,17.81 v95.88,18.21
  Bottom 0.813: CANH_3_C3.TP 98.86,41.4 97.21,43.05 v96.22,43.05 80.04,43.05 78.38,41.4 | 78.38,41.4 76.61,39.62 76.61,21.03 CANH_1_C3.TP 79.43,18.21 v95.88,18.21 98.15,18.21 99.67,19.71 CANH_2_C3.TP | CANH_4_C3.TP 78.38,41.4
CANH_C4  (via drill 0.6)
  Top 0.305: X2.4 5.19,32.22 v5.13,32.28
  Bottom 0.305: v5.13,32.28 9.55,32.28 10.97,30.86 10.97,25.63 12.73,23.88 15.14,23.88 CANH_1_C4.TP
  Bottom 0.813: CANH_1_C4.TP 19.61,19.86 21.23,18.24 39.24,18.24 CANH_3_C4.TP 40.87,20.07 42.24,21.44 42.24,40.08 CANH_4_C4.TP 39.17,43.16 21.54,43.16 19.84,41.45 CANH_2_C4.TP
CANL  (via drill 0.6)
  Top 0.305: 213.65,6.24 213.72,6.3 | 214.3,6.86 U$1.6 214.27,8.25 214.27,6.86 214.25,6.83 213.72,6.3 | 213.72,6.27 213.72,6.3 | 191.97,11.02 v191.95,10.95
  Top 0.813: R16.1 213.65,6.24 | CANL_C1.TP v186.31,7.67 | v186.97,33.35 194.97,33.35 v195.07,33.25 | 214.3,6.86 213.72,6.27 | 214.25,6.83 214.25,9.88 213.11,11.02 191.97,11.02
  Bottom 0.305: 186.33,7.65 v186.31,7.67
  Bottom 0.813: CANL_3_C1.TP 210.82,41.25 199.97,41.25 197.59,38.86 CANL_4_C1.TP 195.07,36.09 v195.07,33.25 195.07,23.85 196.32,22.61 CANL_1_C1.TP 197.31,22.33 197.31,22.12 199.72,19.71 212.34,19.71 213.46,20.83 CANL_2_C1.TP | v186.31,7.67 184.51,7.67 183.72,8.46 183.72,32.54 184.53,33.35 v186.97,33.35 | v191.95,10.95 191.95,8.74 190.86,7.65 186.33,7.65
CANL_C3  (via drill 0.6)
  Top 0.406: X1.3 105.46,49.12 106.58,50.24 108.38,50.24 108.97,49.66 108.97,40.36 v107.34,38.73
  Top 0.813: CANL_C3.TP 95.5,5.97 93.83,7.65 93.83,19.15 v93.75,19.53
  Bottom 0.406: v107.34,38.73 97.33,38.73 96.88,39.19
  Bottom 0.813: CANL_3_C3.TP 96.88,39.19 96.88,39.45 94.74,41.58 83.72,41.58 CANL_4_C3.TP 78.26,36.12 78.26,24.99 80.64,22.61 CANL_1_C3.TP 83.87,19.53 v93.75,19.53 93.62,19.48 CANL_2_C3.TP
CANL_C4  (via drill 0.6)
  Top 0.305: X2.3 17.42,31.72 18.77,33.07 18.77,38.53 v18.82,38.58
  Bottom 0.305: v18.82,38.58 21.87,38.58 CANL_2_C4.TP
  Bottom 0.813: CANL_2_C4.TP 21.95,39.01 24.69,41.76 34.85,41.76 CANL_4_C4.TP 38.53,38.66 40.79,36.4 40.79,25.5 CANL_3_C4.TP 35.08,19.79 24.69,19.79 21.95,22.53 CANL_1_C4.TP
CMOD
  Top 0.305: U1.29 231.39,28.85 231.39,12.37 229.08,10.06 229.07,10.06 C4.1 | 227.66,8.9 R18.2
  Top 0.813: 227.66,8.9 C4.1
CTANK
  Top 0.305: U1.30 232.05,28.91 232.05,10.32 C5.1
GND3  (via drill 0.6)
  Top 0.406: R21.2 86.06,29.56 R7.1 89.87,29.53 v89.87,26.19 | X1.6 v97.77,50.62 v97.76,50.62 | v97.79,48.59 99.64,48.59 X1.2 97.87,48.62 97.82,48.56 97.82,44.47 v97.87,44.3 | v89.89,26.14 75.26,26.14 v75.16,26.03
  Top 0.813: GND_C3.TP v107.31,55.4
  Bottom 0.406: v97.76,50.62 97.76,48.62 v97.79,48.59 | U4.12 89.61,30.68 89.84,30.45 91.54,30.45 U4.13 92.43,30.5 92.74,30.2 92.74,27.03 91.87,26.16 89.92,26.16 | 89.92,26.16 89.89,26.16 v89.87,26.19 | 89.92,26.16 v89.89,26.14
  Bottom 0.813: GND_2_C3.TP GND_1_C3.TP v75.16,26.03 GND_4_C3.TP v97.87,44.3 98.63,44.32 GND_3_C3.TP 102.62,44.17 107.85,44.17 109.22,45.54 109.22,54.76 108.58,55.4 v107.31,55.4
  pour Top (isolate 0.762): 61.04,3 114.88,2.62 114.73,13.26 116.92,13.13 116.61,48.03 114.78,47.85 114.68,58.24 61.04,58.24
  pour Bottom (isolate 0.762): 61.04,2.9 114.58,3.02 114.53,13.33 116.99,13.36 116.76,48.13 114.66,47.88 114.53,58.29 61.04,58.24
GND4  (via drill 0.6)
  Top 0.305: R22.2 30.84,29.71 R9.1 30.98,29.72 34.87,29.72 35.38,30.23 v35.38,30.53 | X2.2 6.78,31.22 6.05,30.48 4.24,30.48 3.56,31.17 3.56,33.15 4.22,33.81 4.39,33.81 | 5.69,33.81 5.71,33.81 6.32,33.2 8.06,33.2 X2.6 6.28,33.22 5.69,33.81 | 5.69,33.81 4.39,33.81 | 4.39,33.81 3.61,34.59 3.61,42.34 v5.69,44.42 | 27.28,16.99 v27.23,16.94
  Top 0.406: 27.28,16.99 26.31,16.99 24.71,18.59 24.71,27.14 R22.2
  Top 1.93: GND_REINFORCEMENT.TP 10.46,21.92 v10.41,21.97
  Bottom 0.305: U5.12 30.66,30.81 30.94,30.53 32.61,30.53 | 32.61,30.53 U5.13 | v5.69,44.42 16.18,44.42 GND_4_C4.TP | 32.61,30.53 v35.38,30.53
  Bottom 0.813: GND_1_C4.TP v27.23,16.94 GND_2_C4.TP GND_3_C4.TP GND_4_C4.TP
  Bottom 1.93: v10.41,21.97 13.56,21.97 15.93,19.61 15.93,17.25 GND_1_C4.TP
  pour Top (isolate 0.762): 2.59,3.17 57.53,3.17 57.53,58.09 2.39,58.09 2.39,3.23
  pour Bottom (isolate 0.762): 2.59,3.17 57.53,3.17 57.53,58.09 2.39,58.09 2.39,3.23
GND_C1  (via drill 0.6)
  Top 0.305: 225.37,6.98 R18.1 | U1.17 225.76,25.98 223.82,27.92 223.82,37.34 223.85,37.36 223.85,38.53 U1.49 223.03,43.73 223.8,44.5 224.88,44.5 C7.2 | U1.10 220.94,28.1 220.94,28.13 222.07,29.26 222.07,34.65 | 222.07,34.65 U1.57 | CN1.D- 210.29,50.88 210.95,51.54 212.29,51.54 213.46,52.7 220.64,52.7 C10.2 220.83,52.93 220.57,52.68 218.36,52.68 217.4,51.71 217.4,50.85 v217.3,50.75 | C5.2 227.86,6.95 C4.2 225.48,6.87 R18.1 | R18.1 225.08,6.73 R17.2 222.84,8.97 C6.2 222.9,10.94 222.25,11.58 | 222.25,11.58 216.15,11.58 | 216.15,11.58 216.13,11.58 215.54,12.17 215.54,12.19 | 215.54,12.19 215.54,14.4 | 215.54,14.4 U$1.2 215.54,14.43 215.54,14.4 | R19.2 R4.2 199.96,29.71 v198.83,28.19 192.05,28.22 v191.85,28.25 | 222.07,34.65 222.07,34.67 218.67,38.08 218.67,39.62 v218.62,39.67 | R13.1 231.88,44.24 231.88,53.06 231.33,53.6 C8.2 C9.2 225.33,53.6 224.94,53.21 224.94,50.22 v224.89,49.81 | 215.54,12.19 216.15,11.58 | 222.25,11.58 226.44,11.58 v226.47,11.56 | v219.23,21.36 v222.5,21.36 219.25,21.36 v219.23,21.34
  Top 0.813: 224.88,44.5 v222.55,44.47
  Top 1.93: GND_C1.TP v188.87,53.24
  Bottom 0.305: U2.12 206.81,30.76 206.98,30.58 U2.13 211.02,30.58 211.84,29.77 211.84,26.39 211.12,25.68 199.64,25.68 198.96,26.36 198.96,28.32 v198.83,28.19 | v218.62,39.67 221.11,39.67 222.33,40.89 222.33,44.25 v222.55,44.47 | v226.47,11.56 226.47,15.75 222.55,19.66 222.55,21.11 v222.5,21.36 | v219.23,21.36 v219.23,21.34 | v219.23,21.34 219.23,16.97 GND_2_C1.TP | v219.23,21.34 219.23,16.99 219.3,16.92
  Bottom 0.61: 191.49,43.94 GND_4_C1.TP
  Bottom 0.813: v188.87,53.24 192.4,53.24 194.89,50.75 v217.3,50.75 223.95,50.75 v224.89,49.81 225.65,49.05 225.65,45.75 224.41,44.5 v222.55,44.47 221.11,44.5 219.48,44.5 GND_3_C1.TP GND_4_C1.TP v191.85,28.25 GND_1_C1.TP 192.96,16.64 217.88,16.64 218.59,16.92 219.3,16.92
  pour Bottom (isolate 0.762): 179.58,57.94 179.58,48.08 177.57,47.65 177.5,13.36 179.55,13.36 179.55,2.79 232.77,2.79 232.77,57.94 181.25,58.04
  pour Top (isolate 0.762): 179.5,57.84 179.6,47.73 177.44,47.78 177.52,13.33 179.43,13.26 179.5,2.67 232.77,2.84 232.77,57.84
GND_C2  (via drill 0.6)
  Top 0.305: v152.25,29.64 v152.24,29.63 R5.1 148.06,29.4 R20.2 148.1,29.4 148.36,29.67 152.37,29.67 153.42,28.63 153.42,27.23 154.1,26.54 158.17,26.54 159.16,27.53 159.16,35.53 v160.99,37.36
  Top 0.813: GND_C2.TP 167.44,53.29 v167.41,53.26 | R23.2 v163.14,51.56 | GND_C2_C3.TP 133.53,55.37 139.09,49.81 140.54,49.81 | 140.54,49.81 IC1.1 | 140.54,49.81 v140.56,49.83 | v153.03,11.35 153.03,8.15 151.94,7.06 v139.17,7.06
  Bottom 0.305: U3.12 147.73,30.81 148.06,30.48 149.88,30.48 U3.13 150.06,30.66 151.54,30.66 152.25,29.95 v152.25,29.64 | v160.99,37.36 160.99,44.22 GND_1_C2.TP
  Bottom 0.813: v140.56,49.83 161.42,49.83 v163.14,51.56 163.19,51.56 165,53.36 167.31,53.36 v167.41,53.26 168.81,53.26 169.8,52.27 169.8,45.67 168.55,44.42 160.99,44.42 GND_1_C2.TP 160.88,44.22 GND_3_C2.TP 133.1,17.02 133.58,17.02 GND_2_C2.TP 135.1,15.24 DINA.3 135.13,7.06 v139.17,7.06 | v153.03,11.35 153.03,15.82 154.2,16.99 160.86,16.99 GND_4_C2.TP
  pour Top (isolate 0.813): 120.6,2.84 173.66,2.82 173.66,13.28 171.63,13.26 171.63,47.78 173.66,47.75 173.66,58.22 120.5,58.24 120.5,47.57 122.68,47.57 122.68,12.95 120.6,13
  pour Bottom (isolate 0.813): 120.62,2.82 173.69,2.82 173.69,13.28 171.53,13.26 171.53,47.78 173.69,47.75 173.69,58.22 120.45,58.27 120.45,47.6 122.58,47.57 122.58,12.95 120.62,12.98
LED_S1  (via drill 0.6)
  Top 0.305: v202.82,27.94 216.5,27.94 U1.4
  Bottom 0.305: LED1.A v202.82,27.94
LED_S2
  Top 0.305: U1.5 216.37,27.1 186.13,27.1 183.97,29.26 183.97,31.44 183.44,31.98 L_C2.TP
LED_S2_C2  (via drill 0.6)
  Top 0.305: v164.69,31.88 170.76,31.88 L_C2_C1.TP
  Bottom 0.305: LED2.A 144.37,26.64 145.31,25.7 163.58,25.7 164.62,26.75 164.62,31.8 v164.69,31.88
LED_S3
  Top 0.305: U1.6 216.34,26.36 188.9,26.36 188.87,26.39 185.47,26.39 182.55,29.31 L_C3.TP
LED_S3_C3  (via drill 0.6)
  Top 0.406: v107.26,29.31 115.6,29.31 L_C2_C3.TP
  Bottom 0.406: LED3.A 85.95,26.14 86.89,25.2 106.45,25.2 107.31,26.06 107.31,29.26 v107.26,29.31
LED_S4
  Top 0.305: U1.7 216.26,25.58 188.24,25.58 188.21,25.55 184.84,25.55 183.77,26.62 L_C4.TP
LED_S4_C4  (via drill 0.6)
  Top 0.305: v38.46,25.83 39.88,25.83 41.25,27.2 41.25,42.7 40.31,43.64 16.31,43.64 13.84,41.17 13.84,35.58 12.88,34.62 11.23,34.62 X2.9
  Bottom 0.305: LED4.A 27.41,26.36 27.89,25.88 v38.46,25.83
LED_T_S4
  Top 0.406: L_C2_C4.TP 115.49,26.57 104.22,26.57 102.72,28.07 102.72,31.85 101.75,32.82 97.28,32.82 93.7,36.4 93.7,53.57 95.91,55.78 103.17,55.78 103.84,55.12 103.84,52.42 103.53,52.12 X1.9
MOTOR  (via drill 0.6)
  Top 0.305: U1.8 U1.9 220.25,28.46 v216,24.21 | v205.97,4.27 205.97,6.71 S1.3
  Bottom 0.305: v216,24.21 219.51,24.21 220.7,23.01 220.7,19.84 224.79,15.75 224.79,12.65 223.95,11.81 217.7,11.81 216.89,11 216.89,5.64 215.57,4.32 206.02,4.32 v205.97,4.27
N$1
  Top 0.305: CN1.D+ 209.47,52.55 210.46,53.54 215.72,53.54 217.88,55.7 222.04,55.7 R1.1
N$2
  Top 0.305: R2.1 199.59,46.91 200.46,46.05 207.85,46.05 208.64,46.84 208.64,49.47 CN1.ID
N$3
  Top 0.305: CN1.GND 207.87,47.3 207.31,46.74 203.12,46.74 202.29,47.57 202.29,49.95 R3.1
N$4
  Top 0.305: R13.2 229.71,42.78 230.45,42.04 230.96,42.04 231.6,41.4 231.6,40.32 R11.2
N$5
  Top 0.305: 215.57,5.32 R16.2 | 215.6,5.27 R16.2 | S1.4 208.25,9.27 208.79,8.74 208.79,4.6 209.78,3.61 214.96,3.61 215.57,4.22 215.57,5.29 R16.2
  Top 0.406: 215.62,8.33 U$1.7
  Top 0.813: U$1.7 215.57,5.32
N$7  (via drill 0.6)
  Top 0.813: CANH_C2_C3.TP 125.98,9.91 127.1,11.02 127.1,12.06 128.3,13.26 136.88,13.26 v136.93,13.21 137.06,13.33 v145.87,13.33 | CANH_C2.TP 168.15,10.82 v168.12,10.85
  Bottom 0.813: v136.93,13.21 136.93,19.13 CANH_1_C2.TP 134.44,21.61 134.44,39.88 136.25,41.68 137.44,41.68 138.86,43.1 155.52,43.1 157.1,41.53 CANH_2_C2.TP | v168.12,10.85 168.05,10.8 166.47,9.22 152.43,9.22 | v145.87,13.33 147.52,13.33 148.34,12.52 148.34,10.92 150.04,9.22 152.43,9.22 | 158.09,41.58 CANH_2_C2.TP | CANH_4_C2.TP 137.36,41.58 138.94,43.16 155.42,43.16 157.02,41.55 158.06,41.55 CANH_2_C2.TP | CANH_3_C2.TP 153.03,19.69 151.61,18.26 151.61,10.03 152.43,9.22
N$8  (via drill 0.6)
  Top 0.406: R7.2 89.84,33.96 v89.05,34.75
  Bottom 0.406: U4.3 U4.2 89.05,32.29 v89.05,34.75
N$9
  Top 0.305: R17.1 217.42,6.73 216.84,7.31 U$1.8
N$10
  Top 0.406: SDA_S3_C1_C1.TP 128.9,18.39 132.31,14.99 161.77,14.99 165.18,18.39 170.92,18.39 SDA_S3_C3_C3.TP
N$11  (via drill 0.6)
  other vias: 211.66,52.55
N$12  (via drill 0.6)
  other vias: 207.26,52.55
N$13
  Top 0.813: DN_C1.TP 192.4,4.8 194.34,6.73 S1.2
N$14  (via drill 0.6)
  Top 0.305: R19.1 200.95,31.61 v200.81,31.6
  Bottom 0.305: v200.81,31.6 202.76,31.6 LED1.C
N$15  (via drill 0.6)
  Top 0.813: v142.44,31.37 144.28,31.39 R20.1
  Bottom 0.813: LED2.C 142.58,31.4 v142.44,31.37
N$16  (via drill 0.6)
  Top 0.406: R21.1 84.03,31.43 v84,31.42
  Bottom 0.406: v84,31.42 85.72,31.42 LED3.C
N$17  (via drill 0.6)
  Top 0.305: R22.1 25.26,31.61 v25.25,31.62
  Bottom 0.305: v25.25,31.62 27.32,31.62 LED4.C
N$18
  Top 0.813: LED5.C 159,51.59 R23.1
N$19  (via drill 0.6)
  Top 0.813: v163.47,4.75 172.92,4.75 DN_C2.TP
  Bottom 0.813: DINA.1 130.02,4.93 130.99,3.96 162.69,3.96 v163.47,4.75
N$20
  Top 0.406: L_C1_C4.TP 127.69,26.62 128.57,25.73 128.57,22.91 133.81,17.68 160.2,17.68 165.05,22.53 165.05,25.81 165.89,26.64 170.79,26.64 L_C4_C1.TP
N$21  (via drill 0.6)
  Top 0.305: v204.7,35.33 204.7,31.66 R4.1
  Bottom 0.305: U2.2 206.08,34.46 205.23,35.31 204.72,35.31 v204.7,35.33
  Bottom 0.406: U2.2 U2.3
N$22
  Top 0.406: L_C1_C3.TP 128.32,29.39 129.69,28.02 129.69,23.95 134.67,18.97 159.54,18.97 163.68,23.11 163.68,27.97 164.97,29.26 170.66,29.26 L_C3_C2.TP
N$23  (via drill 1.6)
  other vias: 213.59,30.61
N$24  (via drill 1.6)
  other vias: 205.59,38.61
N$25  (via drill 1.6)
  other vias: 197.59,30.61
N$26
  Top 0.406: SCL_S3_C1_C3.TP 128.14,21.18 133.1,16.23 161.06,16.23 165.96,21.13 170.84,21.13 SCL_S3_C3_C1.TP
N$27
  Top 0.406: SCL_S4_C1_C4.TP 130.33,37.29 132.56,35.05 132.56,27.13 133.93,25.76 159.23,25.76 160.45,26.97 160.45,32.94 164.85,37.34 170.76,37.34 SCL_S4_C4_C1.TP
N$28  (via drill 1.6)
  other vias: 205.56,22.61
N$29  (via drill 0.6)
  Top 0.813: 188.9,50.34 v188.93,50.37
  Top 1.93: VCC_C1.TP 188.9,50.34
  Bottom 0.61: VCC_2_C1.TP 188.82,14.1
  Bottom 0.813: 188.93,47.27 VCC_4_C1.TP
  Bottom 1.93: VCC_3_C1.TP VCC_4_C1.TP VCC_2_C1.TP VCC_1_C1.TP | v188.93,50.37 188.93,47.27
N$30  (via drill 1.6)
  other vias: 139.14,30.61
N$31  (via drill 1.6)
  other vias: 147.14,38.63
N$32  (via drill 0.6)
  Top 0.813: CANL_C2_C3.TP 127.28,5.99 128.09,6.81 128.09,9.55 128.9,10.36 138.99,10.36 v139.04,10.31 139.06,10.34 v145.8,10.34 | CANL_C2.TP 167.94,7.72 v167.92,7.7
  Bottom 0.813: v139.04,10.31 139.04,16.48 | 139.04,16.48 139.04,22.48 139.14,22.58 | v167.92,7.7 163.14,7.7 160.99,5.54 147.68,5.54 146.18,7.04 146.18,9.96 v145.8,10.34 | CANL_4_C2.TP 152.78,22.68 150.67,20.57 150.67,18.95 149.71,17.98 140.54,17.98 139.04,16.48 | 139.06,38.71 139.06,40.56 140.51,42.01 153.72,42.01 155.17,40.56 CANL_2_C2.TP 155.12,38.66 155.12,40.59 153.7,42.01 140.56,42.01 139.06,40.51 CANL_3_C2.TP 135.76,35.28 135.76,24.77 137.95,22.58 139.14,22.58 | 139.14,22.58 CANL_1_C2.TP
N$33  (via drill 1.6)
  other vias: 155.14,30.61
N$34  (via drill 1.6)
  other vias: 147.14,22.61
N$35  (via drill 1.6)
  other vias: 80.75,30.61
N$36  (via drill 1.6)
  other vias: 88.75,38.63
N$37  (via drill 1.6)
  other vias: 96.75,30.61
N$38  (via drill 1.6)
  other vias: 88.75,22.61
N$39  (via drill 1.6)
  other vias: 21.97,30.68
N$40  (via drill 1.6)
  other vias: 29.97,38.68
N$41  (via drill 1.6)
  other vias: 37.97,30.68
N$42  (via drill 1.6)
  other vias: 29.97,22.66
N$43  (via drill 0.6)
  Top 0.305: R5.2 148.29,33.58 147.55,34.31 v147.55,35.43
  Bottom 0.305: v147.55,35.43 147.55,32.47 U3.2 U3.3
N$44
  Top 0.406: SDA_S4_C1_C1.TP 129.44,34.75 130.99,33.2 130.99,25.2 136.09,20.09 158.75,20.09 162.43,23.77 162.43,32.31 164.85,34.72 SDA_S4_C4_C3.TP
N$46  (via drill 0.6)
  Top 0.305: R9.2 30.91,33.48 v30.2,34.19
  Bottom 0.305: U5.3 U5.2 30.2,32.42 v30.2,34.19
P0_1
  Top 0.305: U1.40 229.59,37.49 229.59,40.14 R11.1
P0_4
  Top 0.305: U1.43 227.57,37.58 228.19,38.2 228.19,49.14 CRYSTAL.2 229.49,49.28 229.84,49.63 C8.1
P0_5
  Top 0.305: U1.44 227.21,37.93 227.71,38.43 227.71,47.09 226.64,48.16 226.64,49.26 CRYSTAL.1 226.63,51.56 C9.1
SAR_BY  (via drill 0.6)
  Top 0.305: v218.85,8.46 218.85,8.69 219.25,9.09 220.92,9.09 C6.1 | 216.66,32.66 v216.81,32.69 216.69,32.69 217.22,32.69 217.69,32.23 217.69,31.42 | 217.69,31.29 217.69,31.42 | U1.1 217.73,31.38 217.69,31.42
  Bottom 0.305: v216.81,32.69 222.15,32.72 224.05,30.81 224.05,19.33 225.15,18.24 226.8,18.24 228.35,16.69 228.35,8.58 227.71,7.95 219.35,7.95 v218.85,8.46
SCL_S1  (via drill 0.6)
  Top 0.305: U1.2 218.08,30.91 217.37,30.2 215.95,30.2 215.67,30.48 215.67,31.85 215.19,32.33 v210.34,32.33 209.61,31.61 R8.2
  Bottom 0.305: v210.34,32.33 U2.5
SCL_S2
  Top 0.305: SCL_S2_C2.TP 192.05,42.75 193.12,43.81 217.15,43.81 U1.51
SCL_S2_U  (via drill 0.6)
  Top 0.305: v165.15,42.77 170.81,42.77 SCL_S2_C2_C1.TP
  Top 0.406: R10.2 152.45,40.74 v151.16,39.45
  Bottom 0.305: U3.5 152.06,32.41 153.03,33.38 153.03,34.65 153.03,35 153.62,35.58 163.6,35.58 165.15,37.14 v165.15,42.77
  Bottom 0.406: v151.16,39.45 151.16,36.53 153.03,34.65
SCL_S3
  Top 0.305: SCL_S3_C3.TP 194.08,21.08 195.66,19.51 213.73,19.51 U1.12
SCL_S3_U  (via drill 0.6)
  Top 0.406: v100.99,26.64 100.99,23.44 103.28,21.16 v108.46,21.16 115.57,21.16 SCL_S3_C3_C2.TP | R27.1 68.21,11.57 69.62,10.16 89.28,10.16 v89.46,10.34
  Bottom 0.406: U4.5 93.17,32.28 93.7,31.75 93.7,27.66 94.72,26.64 v100.99,26.64 | v89.46,10.34 106.88,10.34 108.51,11.96 108.51,21.11 v108.46,21.16
SCL_S4
  Top 0.305: SCL_S4_C4.TP 188.98,37.31 193.7,42.04 213.98,42.04 U1.58
SCL_S4_U  (via drill 0.6)
  Top 0.406: 92.61,53.72 92.61,36.35 v92.58,36.17 | v107.37,37.11 115.44,37.11 SCL_S4_C4_C2.TP | X1.7 103.9,51.12 104.65,51.87 104.65,55.58 103.68,56.54 95.43,56.54 92.61,53.72 | 92.61,53.72 92.63,53.72
  Bottom 0.406: v92.58,36.17 106.43,36.17 v107.37,37.11
SCL_S4_U_1  (via drill 0.6)
  Top 0.305: v35.26,32.44 35.26,41.48 34.01,42.72 17.07,42.72 16,41.66 16,39.73 16,35.23 14.5,33.73 11.14,33.73 X2.7
  Top 0.406: R25.1 42.71,8.17 44.12,9.58 44.12,43.66 41.61,46.18 14.12,46.18 11.2,43.26 11.2,40.13 v11.46,39.88 | v16.05,39.88 16.15,39.88 16,39.73
  Bottom 0.305: U5.5 35.22,32.41 v35.26,32.44
  Bottom 0.406: v11.46,39.88 v16.05,39.88
SDA_S1  (via drill 0.6)
  Top 0.305: U1.3 218.39,30.58 216.92,29.08 v215.7,29.08 | R6.2 206.55,34.95 v207.21,35.61
  Bottom 0.305: 207.98,34.09 207.54,33.66 207.54,32.39 U2.4 | v215.7,29.08 215.7,32.89 214.5,34.09 207.98,34.09 | v207.21,35.61 207.34,35.61 207.44,35.51 207.44,34.62 207.98,34.09
SDA_S2
  Top 0.305: SDA_S2_C1.TP 190.45,40.06 193.29,42.9 217.35,42.9 U1.52
SDA_S2_U  (via drill 0.6)
  Top 0.305: 149.1,35.48 v149.05,35.43
  Top 0.406: R12.2 156.01,42.14 | 156.01,42.14 156.01,41.81 | 149.1,35.48 153.24,35.48 155.98,38.23 155.98,38.33 | 155.98,38.33 155.98,42.11 156.01,42.14 | SDA_S2_C2_C2.TP 157.68,40.03 155.98,38.33
  Bottom 0.305: v149.05,35.43 149.05,32.44 U3.4
SDA_S3
  Top 0.305: SDA_S3_C1.TP 195.35,18.39 195.66,18.69 213.62,18.69 U1.13
SDA_S3_U  (via drill 0.6)
  Top 0.406: v91.11,34.67 93.04,34.67 93.68,34.04 93.68,22.99 94.97,21.69 98.3,21.69 99.64,20.34 99.64,18.9 100.28,18.26 v109.93,18.26 115.44,18.26 SDA_S3_C3_C4.TP | R26.1 67.06,34.75 65.91,33.6 65.91,11.12 69.06,7.98 89.38,7.98 v89.46,8.05
  Bottom 0.406: U4.4 90.56,34.13 v91.11,34.67 | v89.46,8.05 107.87,8.05 109.93,10.11 v109.93,18.26
SDA_S4
  Top 0.305: U1.59 214.08,41.22 194.21,41.22 189.28,36.3 185.45,36.3 183.79,34.65 SDA_S4_C1.TP
SDA_S4_U
  Top 0.406: SDA_S4_C4_C4.TP 96.72,34.72 95.17,36.27 95.17,49.68 97.13,51.64 99.65,51.64 X1.8
SDA_S4_U_1  (via drill 0.6)
  Top 0.305: v32.41,34.09 33.78,34.09 34.49,34.8 34.49,40.31 32.97,41.83 22.25,41.83 21.39,40.97 21.39,34.14 v20.85,33.6 | v5.41,35.18 5.41,34.95 6.22,34.14 8,34.14 X2.8
  Top 0.406: R24.1 19.16,8.12 18.08,9.19 18.08,30.84 v20.85,33.6
  Bottom 0.305: U5.4 31.69,33.36 v32.41,34.09 | v20.85,33.6 19.33,33.6 18.34,32.61 13.21,32.61 10.69,35.13 5.46,35.13 v5.41,35.18
SWDCLK  (via drill 0.6)
  Top 0.305: R2.2 199.59,53.72 v199.57,54.18 | v225.78,20.52 227.94,20.52 228.6,21.18 228.6,26 U1.21
  Bottom 0.305: v199.57,54.18 199.64,54.1 226.57,54.1 228.02,52.65 228.02,25.91 226.24,24.13 226.19,24.13 225.86,23.8 225.86,20.6 v225.78,20.52
SWDIO  (via drill 0.6)
  Top 0.305: R3.2 202.26,55.58 v202.36,55.68 | U1.20 227.96,25.93 227.96,23.19 227.48,22.71 v227.2,22.71
  Bottom 0.305: v202.36,55.68 227.28,55.68 229.26,53.7 229.29,24.69 v227.2,22.71
VCC_C2  (via drill 0.6)
  Top 0.813: 132.71,11.81 v132.56,11.96 | 158.67,13.67 v158.7,13.82 | IC1.3 148.43,47.21 v148.34,47.12 | VCC_C2_C3.TP 130.45,52.45 v130.48,52.43
  Top 1.422: 132.71,11.81 149.56,11.76 151.59,13.61 158.67,13.67
  Top 1.93: VCC_C2.TP v167.72,50.34
  Bottom 0.813: 130.33,47.17 131.17,47.12 131.17,47.07 VCC_3_C2.TP 130.48,47.14 v130.48,52.43 | v132.56,11.96 132.56,12.06 | 163.78,13.82 VCC_4_C2.TP | 167.03,47.12 167.67,47.75 | 167.67,50.29 v167.72,50.34
  Bottom 1.93: DINA.2 v132.56,11.96 | 132.56,12.06 VCC_1_C2.TP 130.33,47.17 | 131.17,47.12 v148.34,47.12 VCC_2_C2.TP 167.03,47.12 | v158.7,13.82 163.78,13.82 | 167.67,47.75 167.67,50.29
VCC_C3  (via drill 0.6)
  Top 0.406: X1.1 106.51,48.12 v107.23,48.83 | X1.10 95.42,52.62 v95.4,52.6
  Top 0.813: VCC_C3.TP v107.37,52.58
  Bottom 0.406: v107.23,48.83 107.23,49.24 107.37,49.38 | v95.4,52.6 107.34,52.6 v107.37,52.58
  Bottom 0.813: 105.26,47.12 VCC_3_C3.TP 105.74,47.35 v107.23,48.83 107.37,48.97 107.37,49.38 v107.37,52.58
  Bottom 1.27: 93.24,46.81 105.21,46.81 105.74,47.35
  Bottom 1.93: VCC_2_C3.TP 104.09,12.8 73.46,12.8 72.24,14.02 VCC_1_C3.TP 72.24,14.68 71.09,15.82 71.09,45.97 VCC_4_C3.TP 72.24,47.22 73.81,48.79 91.26,48.79 93.24,46.81
VCC_C4  (via drill 0.6)
  Top 0.305: X2.1 11.98,30.72 12.45,30.25 v12.45,17.86
  Top 0.406: X2.10 8.08,36.32 v7.06,37.34
  Top 1.93: VCC_REINFORCEMENT.TP 14.73,11.84 v15.93,13.03
  Bottom 0.305: v12.45,17.86 12.45,15.01 VCC_1_C4.TP
  Bottom 0.406: v7.06,37.34 4.6,37.34 3.61,36.35 3.61,20.19 4.9,18.9 11.4,18.9 v12.45,17.86
  Bottom 1.93: VCC_1_C4.TP 14,14.02 14.99,13.03 v15.93,13.03 17.35,13.03 45.59,13.03 VCC_2_C4.TP 48.84,16.28 48.84,45.47 47.14,47.17 VCC_3_C4.TP 46.58,47.95 45.06,49.48 15.75,49.48 VCC_4_C4.TP
VCCD
  Top 0.305: U1.48 225.68,39.35 224.99,40.03 224.99,42.56 C7.1
VDDA
  Top 0.305: VDDA_C1.TP 192.58,23.85 196.11,20.32 213.83,20.32 U1.11 221.26,27.77 221.31,27.77 222.73,29.19 222.73,34.69 U1.56
VDDA2  (via drill 0.6)
  Top 0.813: VDDA_C2.TP v166.93,23.85 | v163.12,11.2 160.74,11.2 L1.2
  Bottom 0.813: v166.93,23.85 166.93,12.93 165.2,11.2 v163.12,11.2
VDDD
  Top 0.305: VDDD_C1.TP 180.87,55.96 195.4,55.96 197.26,54.1 197.26,47.6 199.67,45.19 216.48,45.19 U1.50
VDDD2
  Top 0.813: L2.2 VDDD_C2.TP
VDDIO
  Top 0.305: U1.26 229.41,28.73 229.41,19.63 227.25,17.47 185.93,17.47 184.28,15.82 179.07,15.82 VDDIO_C1.TP
VDDIO2
  Top 0.813: R15.2 164.74,7.49 165.58,8.33 165.58,14.66 166.67,15.75 170.76,15.75 VDDIO_C2.TP
XRES
  Top 0.305: U1.47 226.85,39.7 226.85,46.91 226.21,47.55 223.6,47.55 222.81,48.34 222.81,50.38 R14.2 C10.1 222.82,52.4 R1.2

### Text on the board
tNames: EMERGE FACE 4 | EMERGE FACE 3
bNames: EMERGE FACE 2 | EMERGE FACE 1